# EAGLE design Trinkey-MonoSwitch (EAGLE 9.6.2)
AUTHOR: ladyada
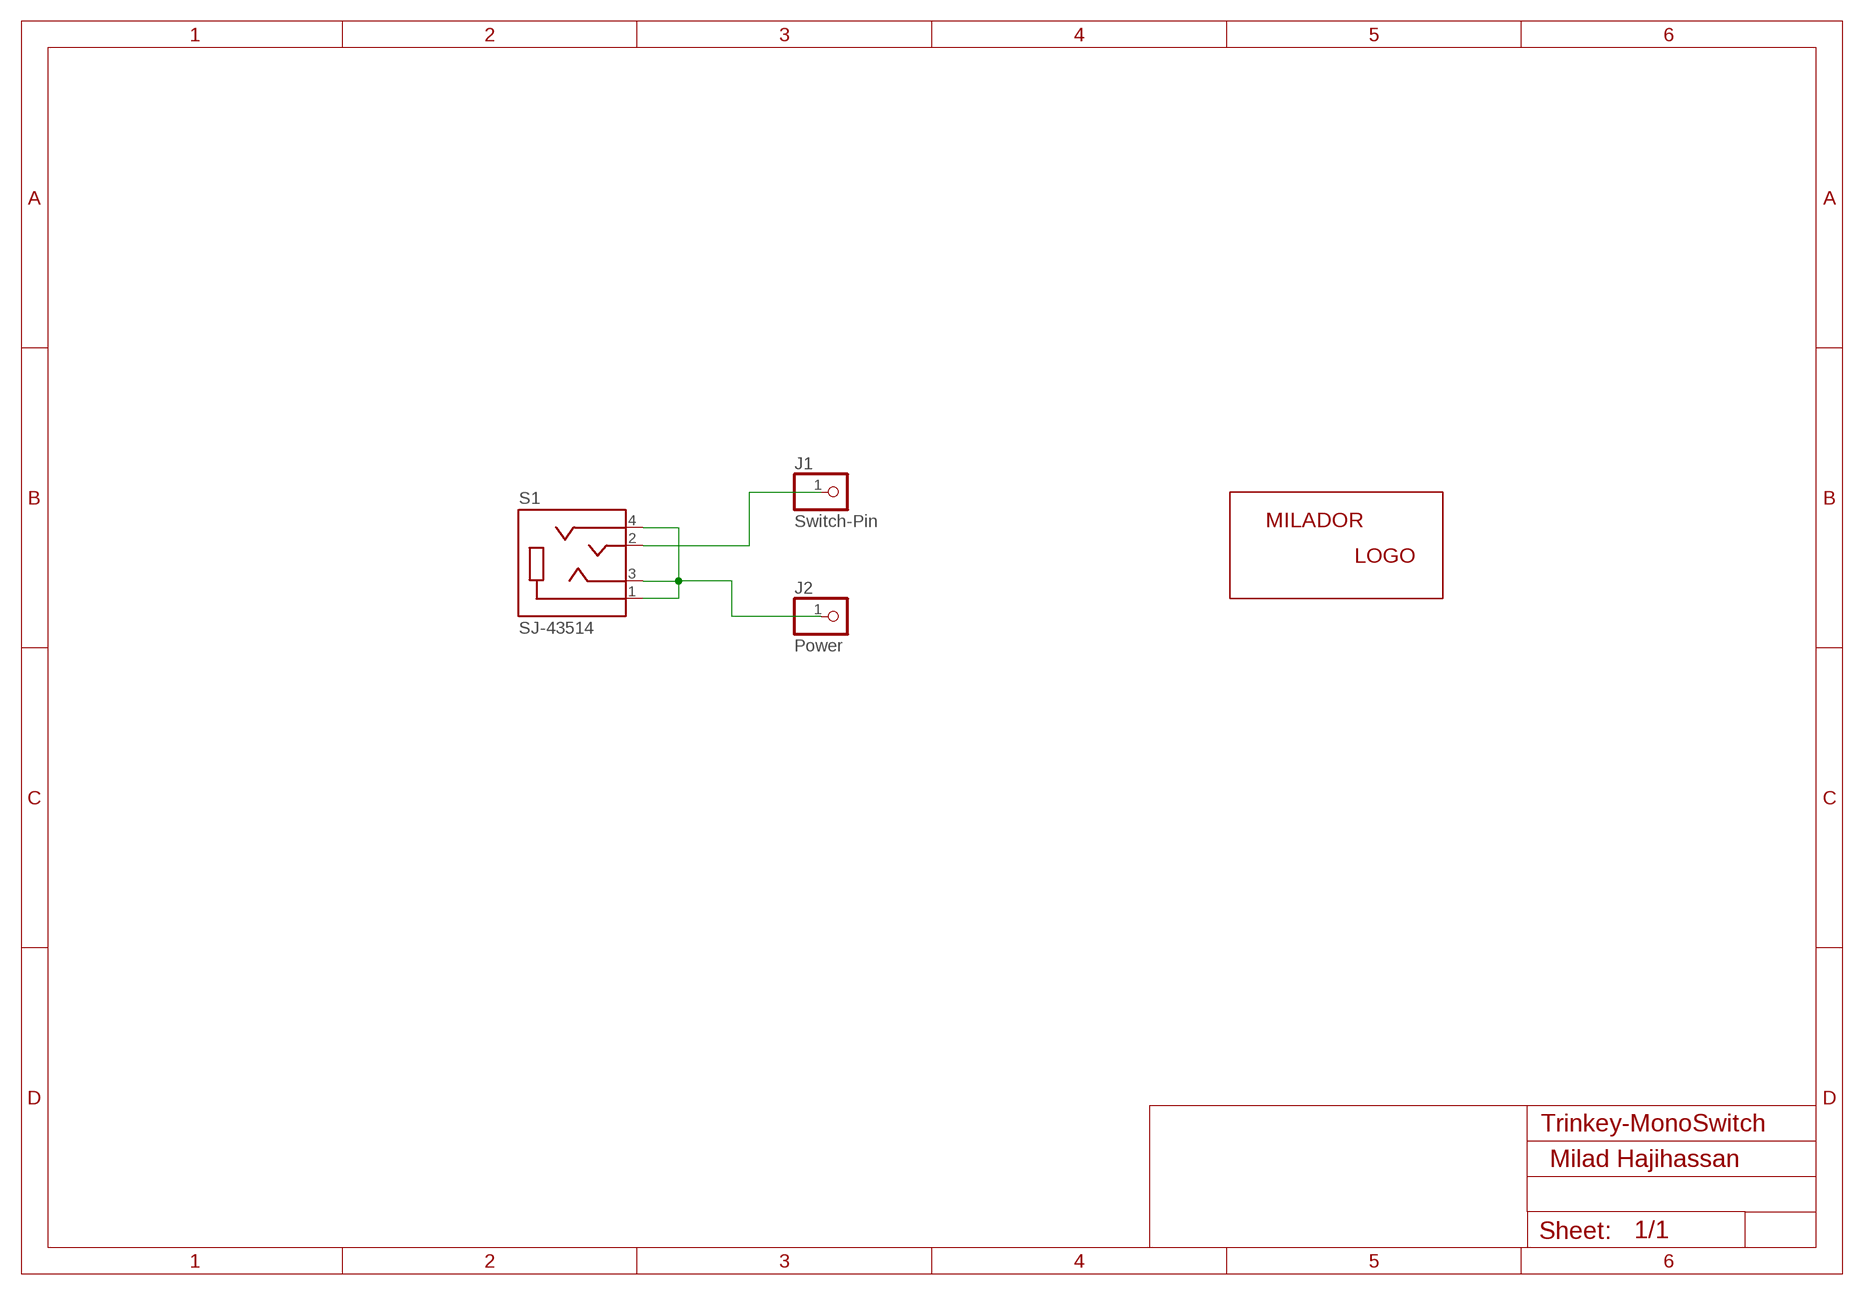
[diagram p0: schematic, sheet 1]

## Parts
J1  Switch-Pin  CASTELLATED_PIN-1X01  [CASTELLATED_PIN-1X01]
J2  Power  CASTELLATED_PIN-1X01  [CASTELLATED_PIN-1X01]
LABEL-LOGO  MILADOR-LOGO-SM  [MILADOR_LOGO2]
S1  SJ-43514  [CUI_SJ-43514]

## Nets
N$1: J1.1 S1.2(TIP)
N$2: J2.1 S1.1(SLEEVE) S1.3(RING1) S1.4(RING2)

## Notes on the sheet
- Milad Hajihassan

## Library data of the parts
J1 J2 = MMC Eagle:CASTELLATED_PIN-1X01
LABEL-LOGO = milador:MILADOR-LOGO-
S1 = MMC Eagle:SJ-43514: SJ-43514 3.50mm (0.141", 1/8", Mini Plug) - Headphone Phone Jack Stereo (4 Conductor, TRRS) Connector. You can use these as jacks to connect analog joysticks or create simple switch interfaces. Options: Digikey - CP-43514-ND <https://www.digikey.ca/en/products/detail/cui-devices/SJ-43514/368146> Mouser - 490-SJ-43514 <https://www.mouser.ca/ProductDetail/CUI-Devices/SJ-43514?qs=WyjlAZoYn51bsBOfuwwiuw%3D%3D>

## Board
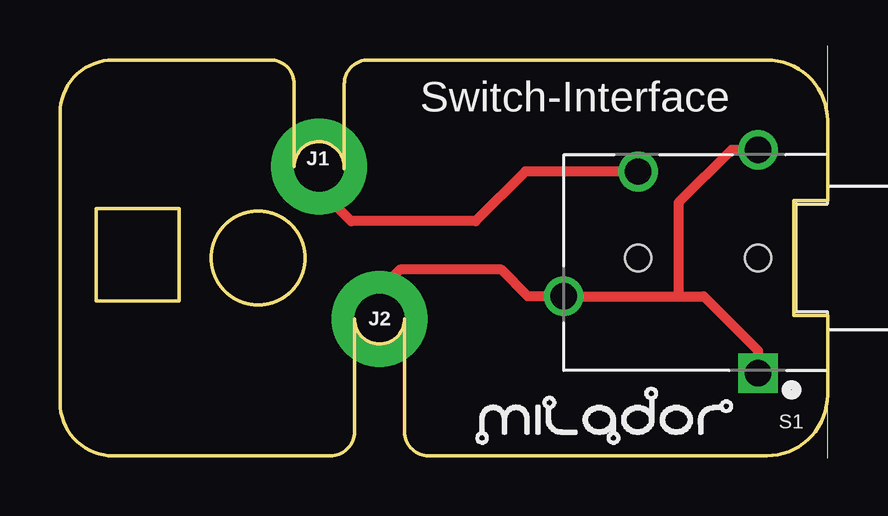
[diagram p1: board, top side]

Size 32 x 16.51 mm. Coordinates in mm from the lower left corner, seen from the top.
Outline: 0,2.22 arc90 2.22,0 11.28,0 arc90 12.28,1 12.28,5.71 arc90 13.32,4.66 arc90 14.36,5.71 14.36,1 arc90 15.36,0 29.46,0 arc90 32,2.54 32,5.86 30.6,5.86 30.6,10.65 32,10.65 32,13.97 arc90 29.46,16.51 12.85,16.51 arc90 11.85,15.51 11.85,11.97 arc90 10.79,13.11 arc90 9.77,12.06 9.77,15.51 arc90 8.77,16.51 2.22,16.51 arc90 0,14.29 0,2.22
Outline: circle at 8.26,8.26 radius 1.95
Copper layers (1*16): Top 0.035mm / dielectric 1.5mm / Bottom 0.035mm
Design rules "adafruit 8-8 *": minimum track width 8mil, minimum drill 15.5mil, track to track 8mil, track to pad 8mil, pad to pad 8mil, via to via 8mil, smd to smd 8mil, copper to edge 10mil, drill to drill 8mil, minimum pad ring 10mil, minimum via ring 8mil, stop-mask expansion 2mil, vias tented up to drill 20mil, thermal gap 10mil
Milling: 4 lines

### Footprints (pad centres in the part's own frame; a part is rotated, then mirrored left to right if it is on the bottom)
CASTELLATED_PIN-1X01 = drill 2.086 pad 4: 1 0,0
CUI_SJ-43514 = drill 1.1 square: 1 -2.6,4.8 | drill 1.1: 2 2.4,-3.6; 3 5.5,1.6; 4 -2.6,-4.5 | hole 1.1: -2.6,0; 2.4,0

### Placement (x,y rotation side)
J1  10.79,12.06 0 top
J2  13.32,5.71 0 top
LABEL-LOGO  22,1.17 0 top
S1  26.5,8.26 180 top

### Tracks (layer width: path | path; a pad name or v marks a point on that pad's centre or on a via)
N$1
  Top 0.406: S1.2 19.4,11.86 17.33,9.79 12.14,9.79 10.79,11.13 J1.1
N$2
  Top 0.406: 25.79,6.66 S1.3 19.51,6.66 18.4,7.76 14.17,7.76 13.32,6.92 J2.1 | 25.79,6.66 26.84,6.66 29.1,4.39 S1.1 | S1.4 27.99,12.76 25.79,10.55 25.79,6.66

### Text on the board
tPlace: Switch-Interface